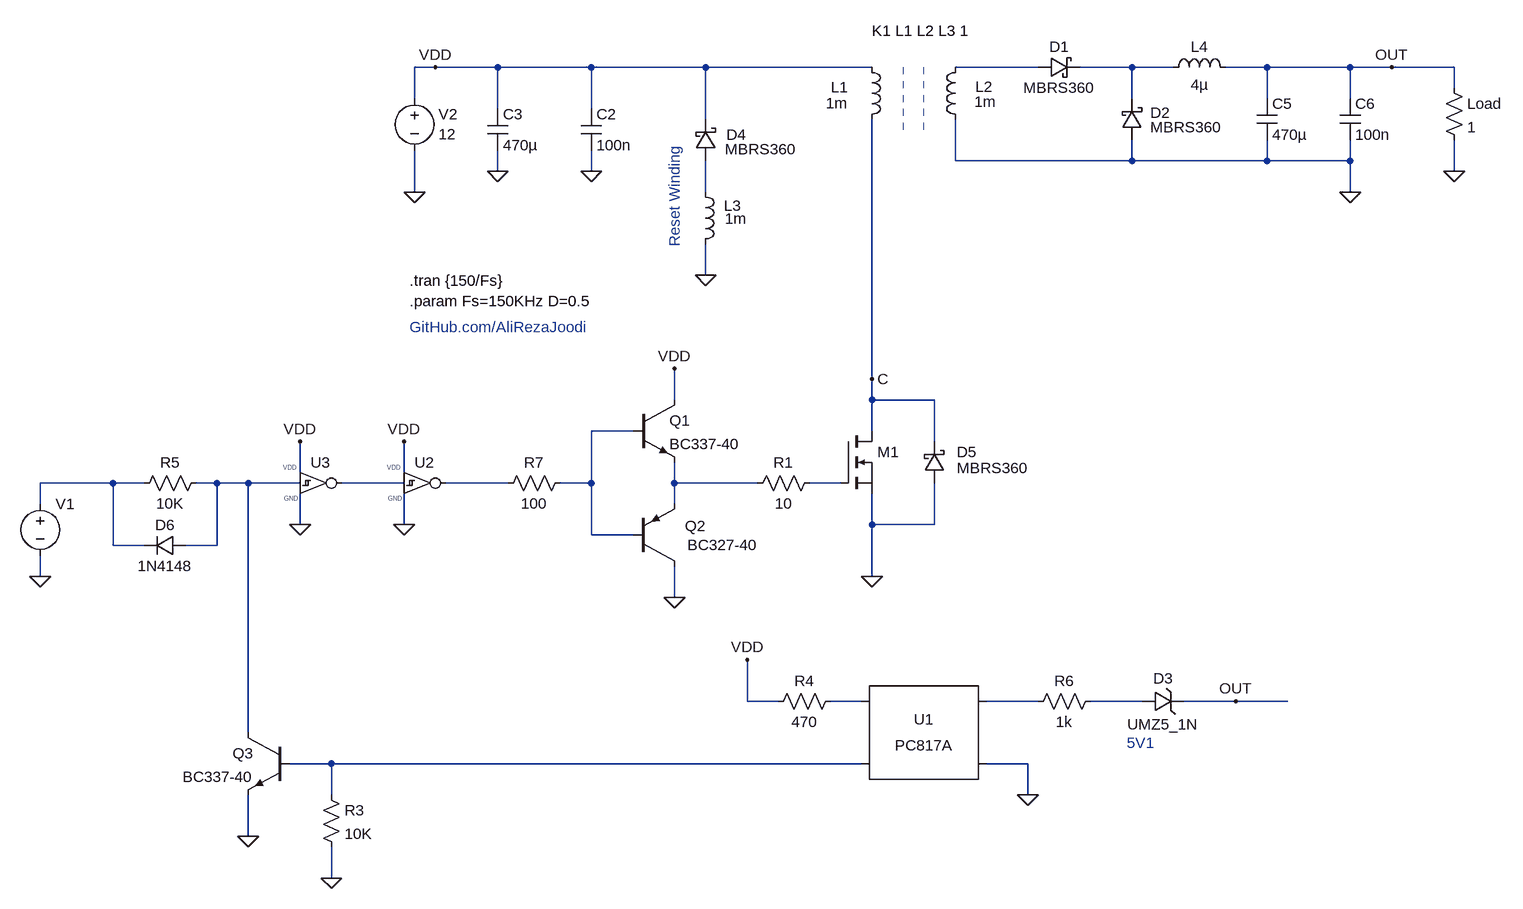
[diagram p0: schematic v1.0.asc]
v1.0.asc, the LTspice schematic file:
Version 4.1
SHEET 1 2268 1656
WIRE 160 96 128 96
WIRE 256 96 160 96
WIRE 400 96 256 96
WIRE 576 96 400 96
WIRE 832 96 576 96
WIRE 1088 96 960 96
WIRE 1232 96 1152 96
WIRE 1296 96 1232 96
WIRE 1440 96 1376 96
WIRE 1568 96 1440 96
WIRE 1632 96 1568 96
WIRE 1728 96 1632 96
WIRE 1728 128 1728 96
WIRE 128 144 128 96
WIRE 1232 144 1232 96
WIRE 1440 144 1440 96
WIRE 1568 144 1568 96
WIRE 256 160 256 96
WIRE 400 160 400 96
WIRE 576 176 576 96
WIRE 960 240 960 176
WIRE 1232 240 1232 208
WIRE 1232 240 960 240
WIRE 1440 240 1440 208
WIRE 1440 240 1232 240
WIRE 1568 240 1568 208
WIRE 1568 240 1440 240
WIRE 256 256 256 224
WIRE 400 256 400 224
WIRE 1728 256 1728 208
WIRE 128 288 128 224
WIRE 576 288 576 240
WIRE 1568 288 1568 240
WIRE 576 416 576 368
WIRE 832 576 832 176
WIRE 528 608 528 560
WIRE 832 608 832 576
WIRE 928 608 832 608
WIRE 464 656 400 656
WIRE 832 656 832 608
WIRE 928 672 928 608
WIRE -48 720 -48 672
WIRE 112 720 112 672
WIRE -336 736 -448 736
WIRE -288 736 -336 736
WIRE -176 736 -208 736
WIRE -128 736 -176 736
WIRE -48 736 -128 736
WIRE 112 736 16 736
WIRE 272 736 176 736
WIRE 400 736 400 656
WIRE 400 736 352 736
WIRE 528 736 528 704
WIRE 656 736 528 736
WIRE 784 736 736 736
WIRE -448 768 -448 736
WIRE 528 768 528 736
WIRE -48 800 -48 752
WIRE 112 800 112 752
WIRE 832 800 832 752
WIRE 928 800 928 736
WIRE 928 800 832 800
WIRE 400 816 400 736
WIRE 464 816 400 816
WIRE -336 832 -336 736
WIRE -288 832 -336 832
WIRE -176 832 -176 736
WIRE -176 832 -224 832
WIRE -448 880 -448 848
WIRE 832 880 832 800
WIRE 528 912 528 864
WIRE 640 1072 640 1008
WIRE 688 1072 640 1072
WIRE 816 1072 768 1072
WIRE 1088 1072 1008 1072
WIRE 1248 1072 1168 1072
WIRE 1392 1072 1312 1072
WIRE 1472 1072 1392 1072
WIRE -128 1120 -128 736
WIRE 0 1168 -64 1168
WIRE 816 1168 0 1168
WIRE 1072 1168 1008 1168
WIRE 0 1216 0 1168
WIRE 1072 1216 1072 1168
WIRE -128 1280 -128 1216
WIRE 0 1344 0 1296
FLAG -448 880 0
FLAG 128 288 0
FLAG 832 880 0
FLAG 400 256 0
FLAG 256 256 0
FLAG 160 96 VDD
FLAG 1632 96 OUT
FLAG 1568 288 0
FLAG 528 560 VDD
FLAG 528 912 0
FLAG 832 576 C
FLAG 576 416 0
FLAG 1728 256 0
FLAG -128 1280 0
FLAG 0 1344 0
FLAG 640 1008 VDD
FLAG 112 672 VDD
FLAG 112 800 0
FLAG -48 672 VDD
FLAG -48 800 0
FLAG 1072 1216 0
FLAG 1392 1072 OUT
SYMBOL voltage -448 752 R0
WINDOW 3 24 96 Invisible 2
WINDOW 123 0 0 Left 0
WINDOW 39 39 69 Left 2
SYMATTR Value PULSE(0 12 0 {0.01/Fs} {0.01/Fs} {D/Fs} {1/Fs})
SYMATTR InstName V1
SYMBOL res 640 752 R270
WINDOW 0 32 56 VTop 2
WINDOW 3 0 56 VBottom 2
SYMATTR InstName R1
SYMATTR Value 10
SYMBOL ind 816 80 R0
WINDOW 0 -47 47 Left 2
WINDOW 3 -55 71 Left 2
SYMATTR InstName L1
SYMATTR Value 1m
SYMATTR Type ind
SYMBOL voltage 128 128 R0
WINDOW 0 37 40 Left 2
WINDOW 3 37 71 Left 2
WINDOW 123 0 0 Left 0
WINDOW 39 0 0 Left 0
SYMATTR InstName V2
SYMATTR Value 12
SYMBOL cap 384 160 R0
SYMATTR InstName C2
SYMATTR Value 100n
SYMBOL cap 240 160 R0
SYMATTR InstName C3
SYMATTR Value 470µ
SYMBOL ind 976 80 M0
WINDOW 0 -42 46 Left 2
WINDOW 3 -47 69 Left 2
SYMATTR InstName L2
SYMATTR Value 1m
SYMATTR Type ind
SYMBOL cap 1424 144 R0
SYMATTR InstName C5
SYMATTR Value 470µ
SYMBOL cap 1552 144 R0
SYMATTR InstName C6
SYMATTR Value 100n
SYMBOL res 1712 112 R0
SYMATTR InstName Load
SYMATTR Value 1
SYMBOL ind 1280 112 R270
WINDOW 0 32 56 VTop 2
WINDOW 3 5 56 VBottom 2
SYMATTR InstName L4
SYMATTR Value 4µ
SYMBOL nmos 784 656 R0
WINDOW 3 56 72 Invisible 2
SYMATTR Value BSC100N06LS3
SYMATTR InstName M1
SYMBOL npn 464 608 R0
SYMATTR InstName Q1
SYMATTR Value BC337-40
SYMBOL pnp 464 864 M180
WINDOW 0 80 62 Left 2
WINDOW 3 84 33 Left 2
SYMATTR InstName Q2
SYMATTR Value BC327-40
SYMBOL res -304 752 R270
WINDOW 0 32 56 VTop 2
WINDOW 3 0 56 VBottom 2
SYMATTR InstName R5
SYMATTR Value 10K
SYMBOL ind 560 384 M180
WINDOW 0 44 75 Left 2
WINDOW 3 46 55 Left 2
SYMATTR InstName L3
SYMATTR Value 1m
SYMATTR Type ind
SYMBOL schottky 1088 112 R270
WINDOW 0 32 32 VTop 2
WINDOW 3 0 32 VBottom 2
SYMATTR InstName D1
SYMATTR Value MBRS360
SYMBOL schottky 1216 208 M180
WINDOW 0 44 42 Left 2
WINDOW 3 44 20 Left 2
SYMATTR InstName D2
SYMATTR Value MBRS360
SYMBOL schottky 560 240 M180
WINDOW 0 48 40 Left 2
WINDOW 3 46 18 Left 2
SYMATTR InstName D4
SYMATTR Value MBRS360
SYMBOL schottky 912 736 M180
WINDOW 0 51 48 Left 2
WINDOW 3 51 23 Left 2
SYMATTR InstName D5
SYMATTR Value MBRS360
SYMBOL npn -64 1120 M0
SYMATTR InstName Q3
SYMATTR Value BC337-40
SYMBOL res -16 1200 R0
SYMATTR InstName R3
SYMATTR Value 10K
SYMBOL zener 1248 1088 R270
WINDOW 0 36 32 VTop 2
WINDOW 3 -4 32 VBottom 2
SYMATTR InstName D3
SYMATTR Value UMZ5_1N
SYMBOL res 784 1056 R90
WINDOW 0 0 56 VBottom 2
WINDOW 3 32 56 VTop 2
SYMATTR InstName R4
SYMATTR Value 470
SYMBOL Optos\\PC817A 912 1120 M0
SYMATTR InstName U1
SYMBOL res 1184 1056 R90
WINDOW 0 0 56 VBottom 2
WINDOW 3 32 56 VTop 2
SYMATTR InstName R6
SYMATTR Value 1k
SYMBOL res 368 720 R90
WINDOW 0 0 56 VBottom 2
WINDOW 3 32 56 VTop 2
SYMATTR InstName R7
SYMATTR Value 100
SYMBOL MyLib\\Digital\\CD40106B 112 704 R0
WINDOW 38 16 64 Invisible 2
SYMATTR InstName U2
SYMATTR SpiceLine vdd=12
SYMBOL MyLib\\Digital\\CD40106B -48 704 R0
WINDOW 38 16 64 Invisible 2
SYMATTR InstName U3
SYMBOL diode -224 816 R90
WINDOW 0 0 32 VBottom 2
WINDOW 3 32 32 VTop 2
SYMATTR InstName D6
SYMATTR Value 1N4148
TEXT 120 456 Left 2 !.param Fs=150KHz D=0.5
TEXT 120 424 Left 2 !.tran {150/Fs}
TEXT 832 40 Left 2 !K1 L1 L2 L3 1
TEXT 528 216 VRight 2 ;Reset Winding
TEXT 120 496 Left 2 ;GitHub.com/AliRezaJoodi
TEXT 1224 1136 Left 2 ;5V1
LINE Normal 880 192 880 96 2
LINE Normal 912 192 912 96 2

The netlist it stands for:
* v1.0.asc
V1 N005 0 PULSE(0 12 0 {0.01/Fs} {0.01/Fs} {D/Fs} {1/Fs})
R1 N009 N010 10
L1 VDD C 1m
V2 VDD 0 12
C2 VDD 0 100n
C3 VDD 0 470µ
L2 N001 0 1m
C5 OUT 0 470µ
C6 OUT 0 100n
R§Load OUT 0 1
L4 N002 OUT 4µ
M1 C N010 0 0 BSC100N06LS3
Q1 VDD N004 N009 0 BC337-40
Q2 0 N004 N009 0 BC327-40
R5 N005 N006 10K
L3 0 N003 1m
D1 N001 N002 MBRS360
D2 0 N002 MBRS360
D4 N003 VDD MBRS360
D5 0 C MBRS360
Q3 N006 N014 0 0 BC337-40
R3 N014 0 10K
D3 N013 OUT UMZ5_1N
R4 N011 VDD 470
X§U1 N012 0 N011 N014 PC817 Igain=1m
R6 N013 N012 1k
R7 N004 N008 100
X§U2 N007 N008 VDD 0 CD40106B vdd=12 speed=2 tripdt=100n  ; pins in out VDD GND
X§U3 N006 N007 VDD 0 CD40106B vdd=5 speed=2 tripdt=100n  ; pins in out VDD GND
D6 N006 N005 1N4148
.model D D
.lib standard.dio
.model NPN NPN
.model PNP PNP
.lib standard.bjt
.model NMOS NMOS
.model PMOS PMOS
.lib standard.mos
.param Fs=150KHz D=0.5
.tran {150/Fs}
K1 L1 L2 L3 1
* Reset Winding
* GitHub.com/AliRezaJoodi
* 5V1
.lib PC817.sub
.lib MyLib/Digital/_CD4xxx.lib
.backanno
.end